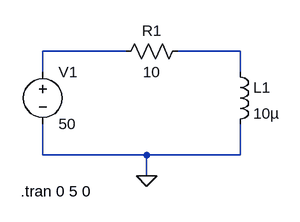
[diagram p0: schematic bobine.asc]
bobine.asc, the LTspice schematic file:
Version 4
SHEET 1 880 680
WIRE 112 112 -16 112
WIRE 288 112 192 112
WIRE -16 144 -16 112
WIRE 288 144 288 112
WIRE -16 272 -16 224
WIRE 144 272 -16 272
WIRE 288 272 288 224
WIRE 288 272 144 272
WIRE 144 304 144 272
FLAG 144 304 0
SYMBOL voltage -16 128 R0
SYMATTR InstName V1
SYMATTR Value 50
SYMBOL res 208 96 R90
WINDOW 0 0 56 VBottom 2
WINDOW 3 32 56 VTop 2
SYMATTR InstName R1
SYMATTR Value 10
SYMBOL ind 272 128 R0
SYMATTR InstName L1
SYMATTR Value 10µ
TEXT -50 328 Left 2 !.tran 0 5 0

The netlist it stands for:
* bobine.asc
V1 N001 0 50
R1 N002 N001 10
L1 N002 0 10µ
.tran 0 5 0
.backanno
.end